# Altium schematic sheet Sheet1.SchDoc
size A4; SheetNumber: 1; SheetTotal: 1
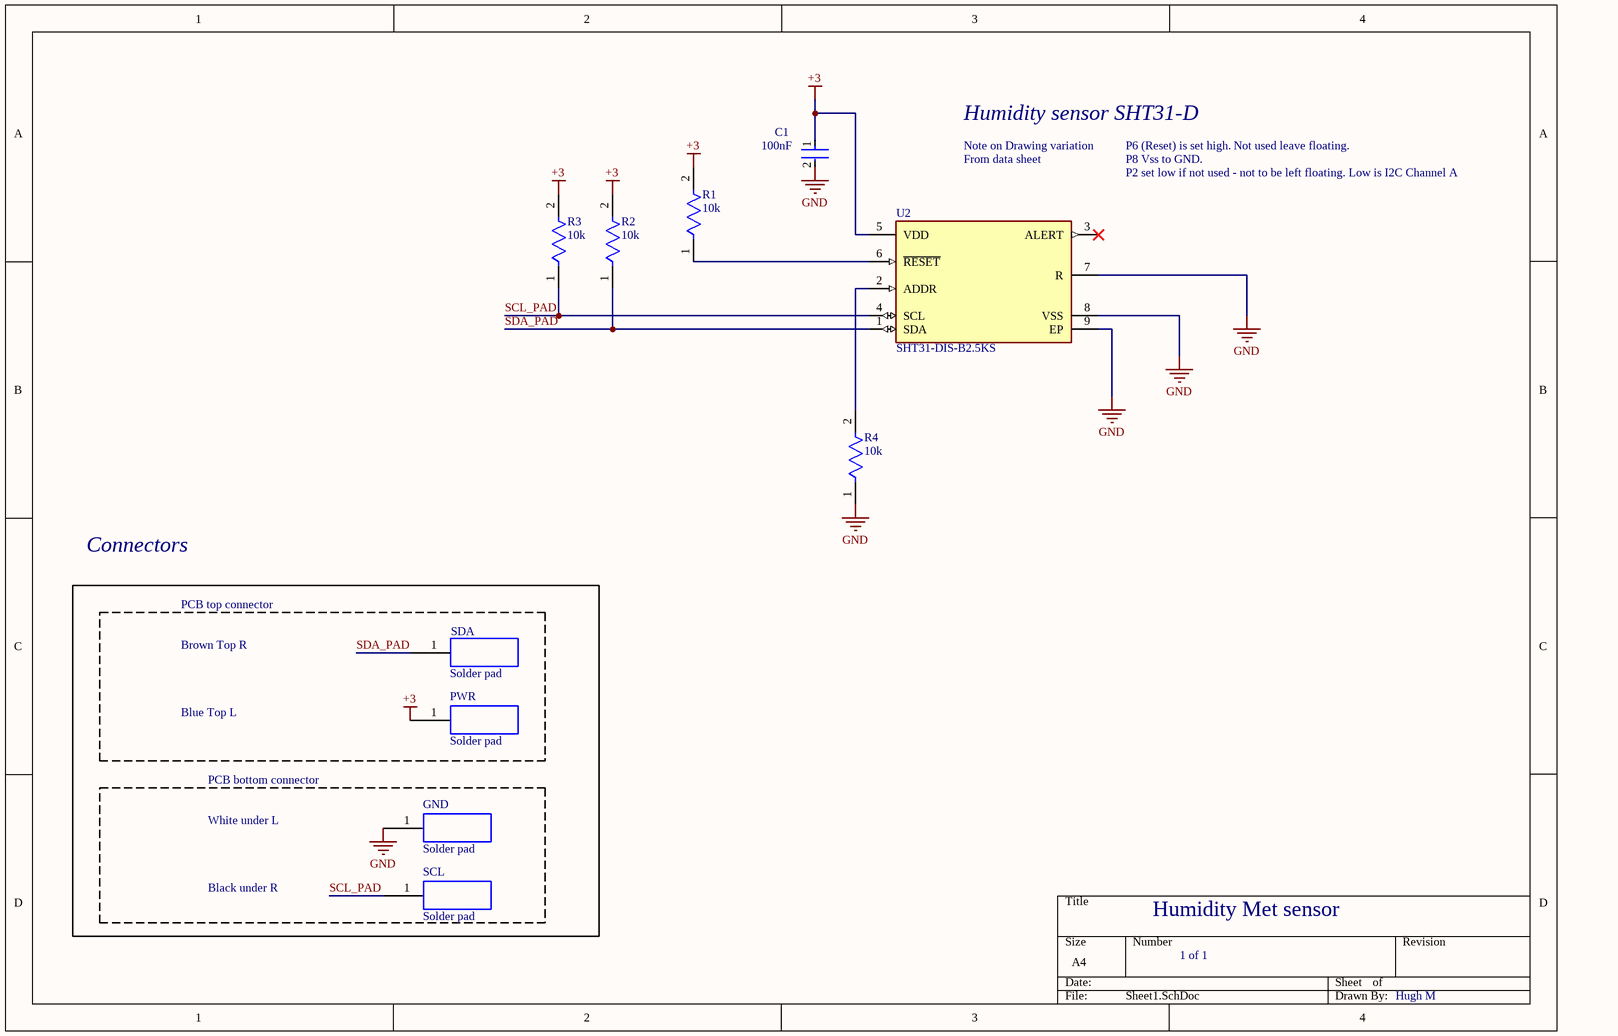
[diagram p0: Sheet1.SchDoc]

## Parts
C1  100nF  [FP-C0402-BB-MFG]
GND  Solder pad  [pad]
PWR  Solder pad  [pad]
R1  10k  [FP-AC0402-MFG]
R2  10k  [FP-AC0402-MFG]
R3  10k  [FP-AC0402-MFG]
R4  10k  [FP-AC0402-MFG]
SCL  Solder pad  [pad]
SDA  Solder pad  [pad]
U2  SHT31-DIS-B2.5KS  [FP-SHT31-DIS-B2_5KS-MFG]  (mechanical)

## Nets
+3: C1.1 PWR.1 R1.2 R2.2 R3.2 U2.5(VDD)
GND: C1.2 GND.1 R4.1 U2.7(R) U2.8(VSS) U2.9(EP)
SCL_PAD: R3.1 SCL.1 U2.4(SCL)
SDA_PAD: R2.1 SDA.1 U2.1(SDA)
NetR1_1: R1.1 U2.6(~{RESET})
NetR4_2: R4.2 U2.2(ADDR)

Not connected (* = marked no-connect by the designer): U2 3(ALERT)*

## Notes on the sheet
- Humidity sensor SHT31-D
- Note on Drawing variation
- From data sheet
- P6 (Reset) is set high.
- P8 Vss to GND.
- P2 set low if not used - not to be left floating. Low is I2C Channel A
- Not used leave floating.
- Connectors
- PCB top connector
- Brown Top R
- Blue Top L
- PCB bottom connector
- White under L
- Black under R
- Humidity Met sensor
- 1 of 1
- Hugh M

## Library data of the parts
C1 = CMP-2008-02046-2: CAP CER 0.1UF 10V X5R 0402; Manufacturer: Kemet; Manufacturer Part Number: C0402C104K8PACTU; Material: Ceramic; Capacitance: 0.10 μF; Temperature Coefficient: 15%; Tolerance: 0.1; Value: 0.10 μF; Package: C0402-BB; Temperature: -55°C to +125°C; ComponentLink2Description: Datasheet; Temperature Characteristic: X5R; Device Class L1: Passive Components; Height: 0.55mm; Lead Free: Yes; ComponentLink2URL: https://content.kemet.com/datasheets/KEM_C1002_X7R_SMD.pdf; Device Class L2: Capacitors; Temperature Range Low: -55°C; Temperature Range High: +125°C; RoHS: TRUE; Octopart: https://octopart.com/c0402c104k8pactu-kemet-140039; Automotive: No; Mouser Description: Capacitor 100 nF 10 VDC 0402; Category: Cap; Voltage Rating: 10 V; Digikey Description: CAP CER 0.1UF 10V X5R 0402; Ipc Land Pattern Name: CAPC10050X50; Device Class L3: Ceramic Capacitors
GND PWR SCL SDA = pad
R1-R4 = CMP-2002-01790-3: RES 10kΩ ±1% 0.063W 0402; Power Rating: 62.5mW; Voltage Rating: 50V; Temperature Coefficient: 100ppm/°C; Resistance: 10kR; Max Power Dissipation: 63mW; Tolerance: 1%; Military Standard: Not; Construction: Rectangular; Termination: SMD/SMT; Max Operating Temperature: 155°C; Min Operating Temperature: -55°C; Height: 0.015inch; Lead Free: Lead Free; Width: 0.02inch; Case/Package: 0402; Resistor Type: Thick Film; Series: AC; Features: Moisture Resistant; RoHS Compliant: Yes; Number of Terminations: 2; Case Code (Metric): 1005; Length: 0.039inch; Depth: 0.5mm; Size Code: 0402; Packaging: Tape and Reel; Case Code (Imperial): 0402
U2 = CMP-144040-000009-1: SENSOR HUMID/TEMP 5V I2C 2% SMD; RoHS Compliant: Yes